# EAGLE schematic BigMuff1 (EAGLE 7.1.0)
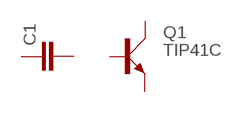
[diagram p0: schematic, sheet 1]

## Parts
C1  C2,5-3  [C2.5-3]
Q1  TIP41C  [TO220AV]
Unconnected: C1.1 C1.2 Q1.B Q1.C Q1.E

## Library data of the parts
C1 = capacitor-wima:C: CAPACITOR naming: grid - package width
Q1 = transistor-power:TIP41C: NPN TRANSISTOR